# EAGLE schematic Power_VIN_5v_LM1117 (EAGLE 6.1)
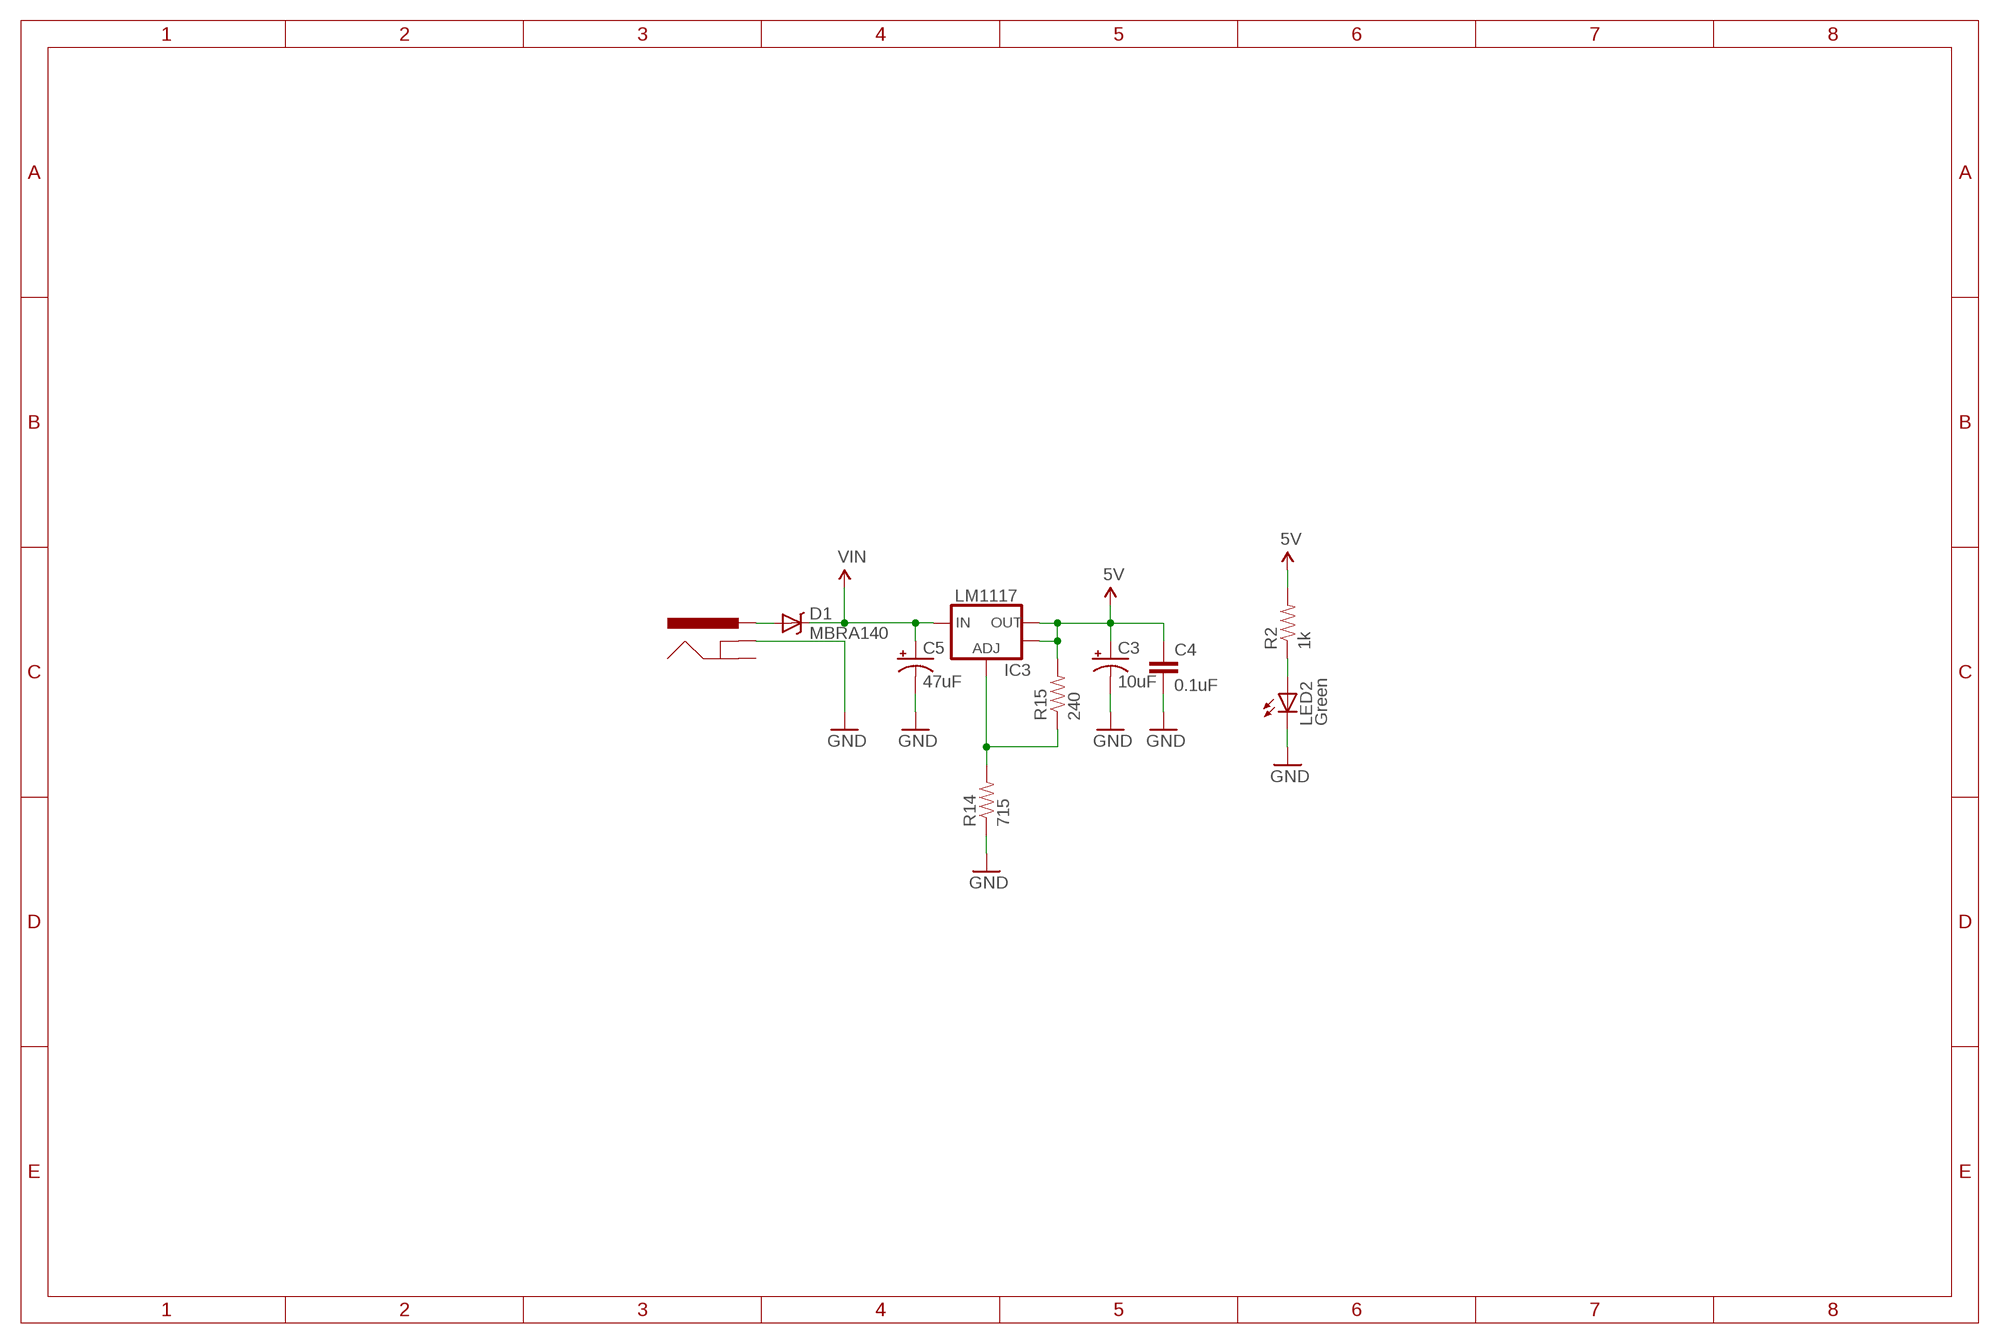
[diagram p0: schematic, sheet 1]

## Parts
C3  10uF  CAP_POL1206  [EIA3216]
C4  0.1uF  CAP0603-CAP  [0603-CAP]
C5  47uF  CAP_POLD  [PANASONIC_D]
D1  MBRA140  DIODE-SCHOTTKY_  [SMA-DIODE]
IC3  LM1117  V_REG_LM1117ALT1  [SOT223-ALT1]
J1  POWER_JACKOVERPASTE_REDBOARD_0603  [POWER_JACK_SMD_OVERPASTE_REDBOARD_0603]
LED2  Green  LED1206-NS  [LED-1206-NO_SILK]
R2  1k  RESISTOR0603-RES  [0603-RES]
R14  715  RESISTOR0603-RES  [0603-RES]
R15  240  RESISTOR0603-RES  [0603-RES]

## Nets
5V: C3.A(+) C4.1 IC3.2(OUT) IC3.4(OUT) R2.2 R15.2
GND: C3.C(-) C4.2 C5.- J1.GND(GNDBREAK) LED2.C R14.1
N$2: LED2.A R2.1
N$15: IC3.1(ADJ) R14.2 R15.1
PWRIN: D1.A J1.VIN0(PWR)
VIN: C5.+ D1.C IC3.3(IN)
Unconnected: J1.P$4(GND)

## Library data of the parts
C3 C5 = SparkFun:CAP_POL: Capacitor Polarized These are standard SMD and PTH capacitors. Normally 10uF, 47uF, and 100uF in electrolytic and tantalum varieties. Always verify the external diameter of the through hole cap, it varies with capacity, voltage, and manufacturer. The EIA devices should be standard.
C4 = SparkFun:CAP: Capacitor Standard 0603 ceramic capacitor, and 0.1" leaded capacitor.
D1 = SparkFun:DIODE-SCHOTTKY
IC3 = Testing:V_REG_LM1117: Voltage Regulator LM1117 Standard adjustable voltage regulator but in SMD form. Spark Fun Electronics SKU : COM-00595
J1 = Testing:POWER_JACK: Power Jack This is the standard 5.5mm barrel jack for power. The PTH is the most common, proven, reliable, footprint. All others are experimental. The Slot footprint only works if the mill layer is transmitted to the PCB fab house so be warned. Spark Fun Electronics SKU : PRT-00119. Mating wall wart : TOL-00298 (and others)
LED2 = SparkFun-LED:LED: LEDs Standard schematic elements and footprints for 5mm, 3mm, 1206, and 0603 sized LEDs. 5mm - Spark Fun Electronics SKU : COM-00529 (and others)
R2 R14 R15 = SparkFun:RESISTOR: Resistor Basic schematic elements and footprints for 0603, 1206, and PTH resistors.

## Net classes
0 default: width 0.152 mm, drill 0.305 mm, clearance 0.152 mm